# EAGLE schematic PowerSupplyCarlos (EAGLE 6.5.0)
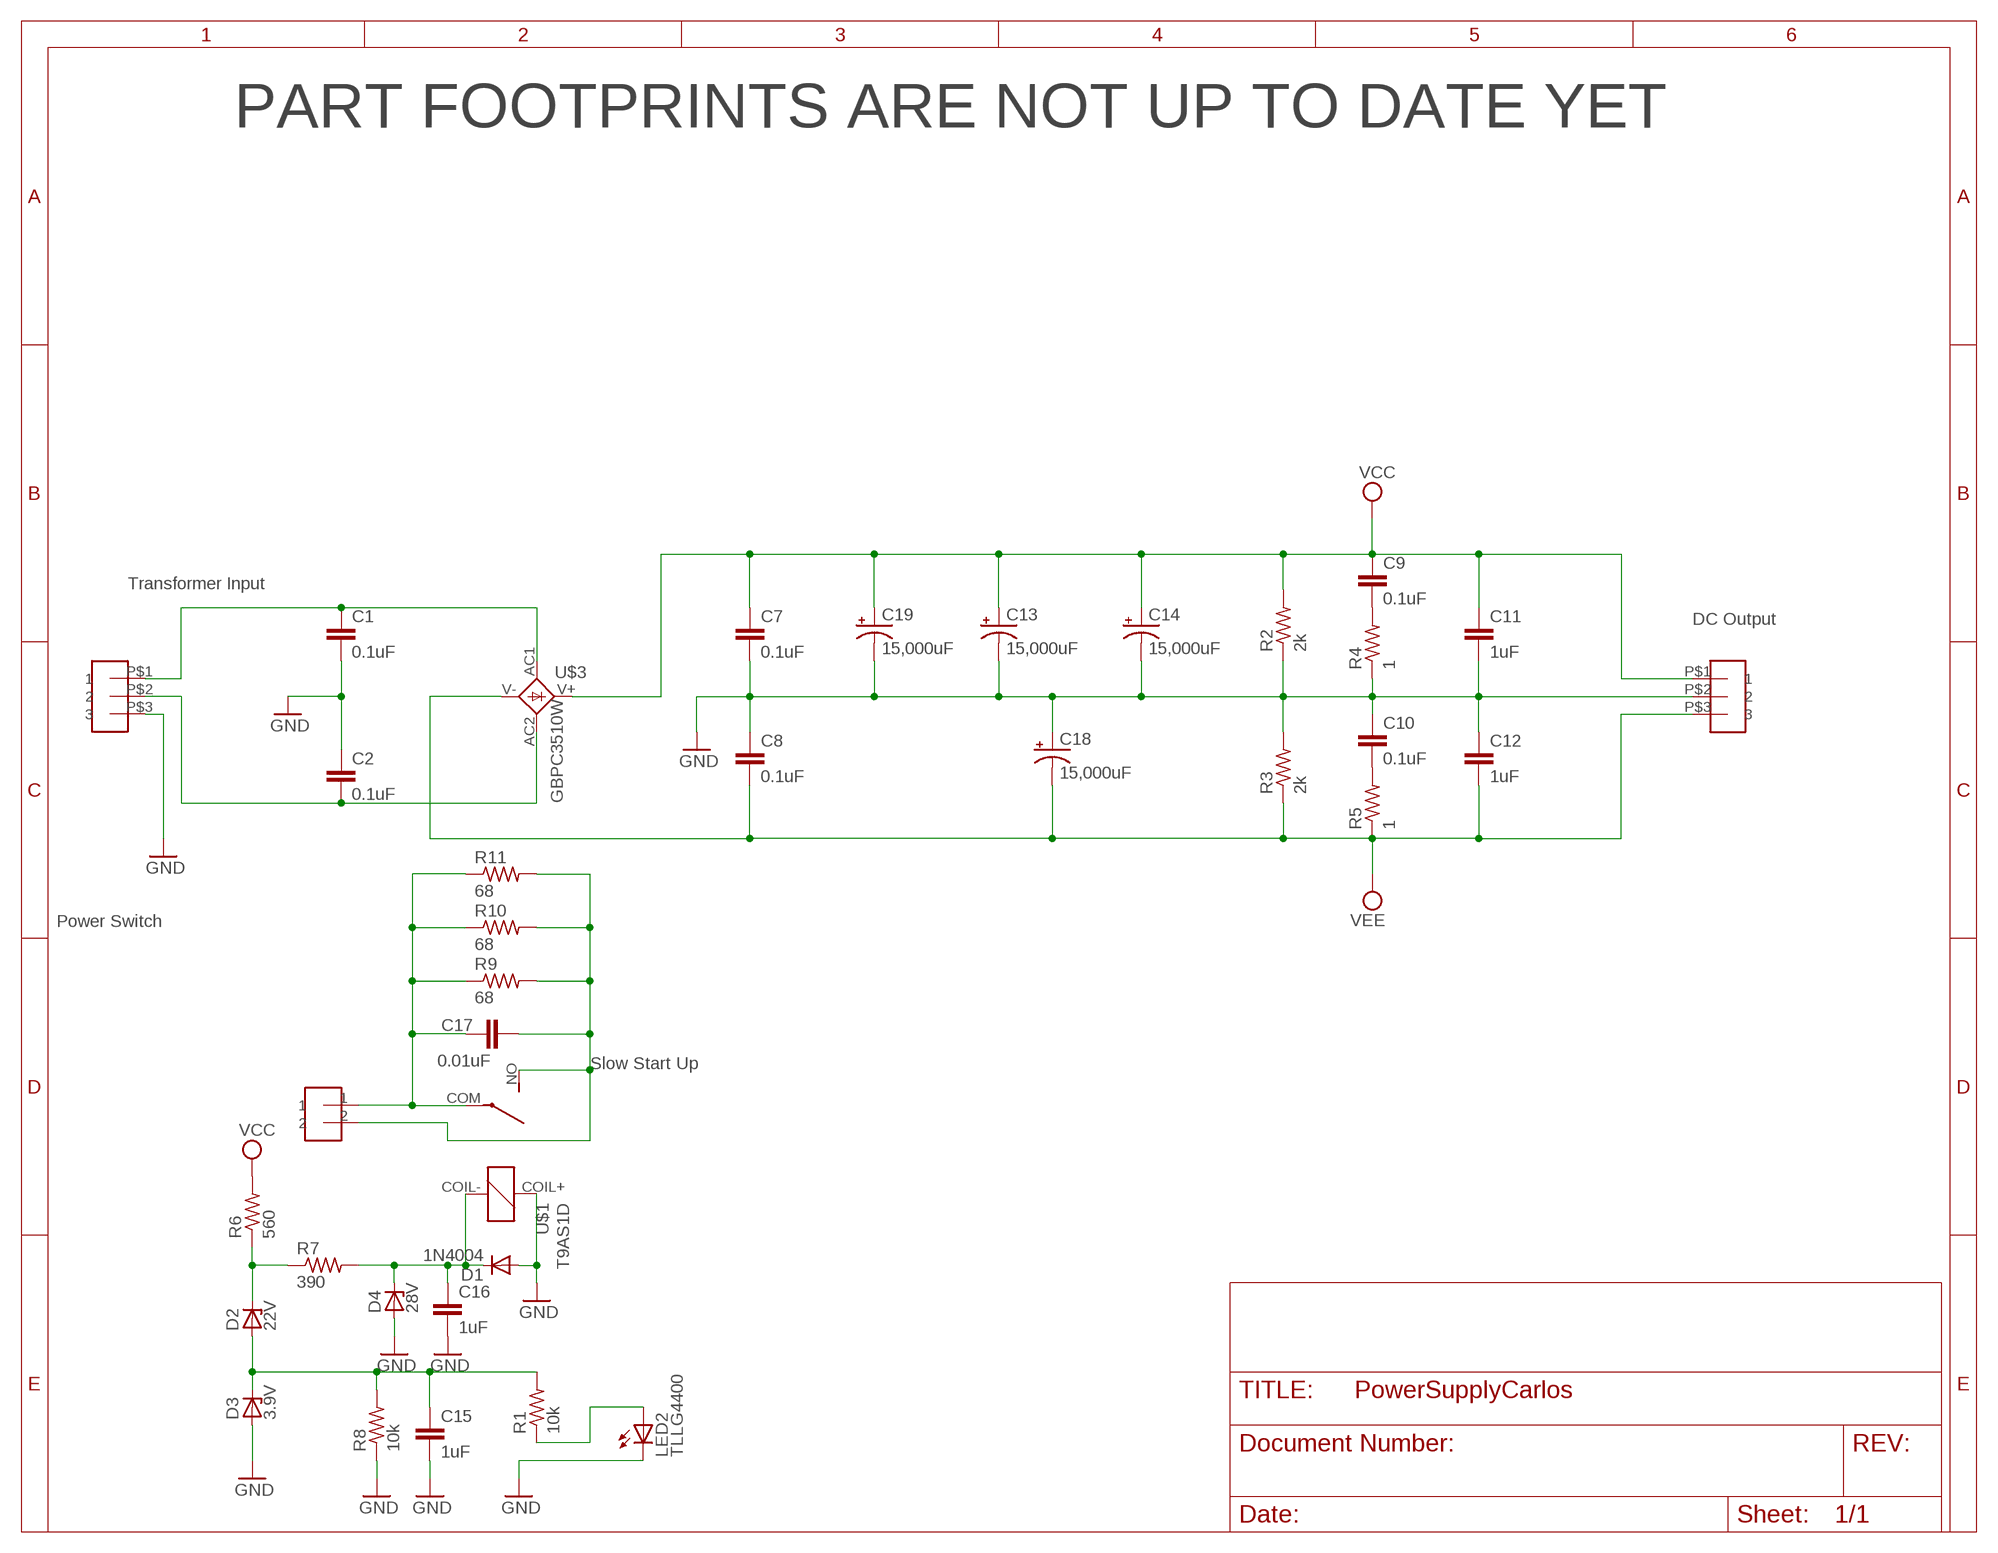
[diagram p0: schematic, sheet 1]

## Parts
C1  0.1uF  C-EU102-064X133  [C102-064X133]
C2  0.1uF  C-EU102-064X133  [C102-064X133]
C7  0.1uF  C-EU102-064X133  [C102-064X133]
C8  0.1uF  C-EU102-064X133  [C102-064X133]
C9  0.1uF  C-EU102-064X133  [C102-064X133]
C10  0.1uF  C-EU102-064X133  [C102-064X133]
C11  1uF  C-EU102-064X133  [C102-064X133]
C12  1uF  C-EU102-064X133  [C102-064X133]
C13  15,000uF  LNR1K153MSE  [PHI-35]
C14  15,000uF  LNR1K153MSE  [PHI-35]
C15  1uF  C-EU025-060X050  [C025-060X050]
C16  1uF  C-EU025-060X050  [C025-060X050]
C17  0.01uF  C-EU025-060X050  [C025-060X050]
C18  15,000uF  36X10222  [PHI-45]
C19  15,000uF  LNR1K153MSE  [PHI-35]
D1  1N4004  [DO41-10]
D2  22V  ZENER-DIODEP1-12  [P1Z12]
D3  3.9V  ZENER-DIODEDO34-7  [DO34Z7]
D4  28V  ZENER-DIODEP1-12  [P1Z12]
LED2  TLLG4400  [LED3MM]
P1  3PIN_3.25MM  [3PIN_SCREW_EYELET]
P2  3PIN_3.25MM  [3PIN_SCREW_EYELET]
R1  10k  R-US_0207/15  [0207/15]
R2  2k  R-US_VTA52  [VTA52]
R3  2k  R-US_VTA52  [VTA52]
R4  1  R-US_0411/12  [0411/12]
R5  1  R-US_0411/12  [0411/12]
R6  560  R-US_0207/15  [0207/15]
R7  390  R-US_0207/15  [0207/15]
R8  10k  R-US_0207/15  [0207/15]
R9  68  R-US_0617/22  [0617/22]
R10  68  R-US_0617/22  [0617/22]
R11  68  R-US_0617/22  [0617/22]
U$1  T9AS1D  [RELAY_CM]
U$3  GBPC3510W  [GBPC3510W]
U$4  1X2HEADER_100MIL  [1X2_100MIL]

## Nets
AC1: C1.1 P1.P$1 U$3.AC1
AC2: C2.2 P1.P$2 U$3.AC2
GND: C1.2 C2.1 C7.2 C8.1 C10.1 C11.2 C12.1 C13.- C14.- C15.2 C16.2 C18.+ C19.- D1.A D3.A D4.A LED2.K(C) P1.P$3 P2.P$2 R2.1 R3.2 R4.1 R8.1 U$1.COIL+
N$1: C10.2 R5.2
N$2: C9.2 R4.2
N$3: C17.1 R9.1 R10.1 R11.1 U$1.COM U$4.1
N$4: LED2.A R1.1
N$8: C17.2 R9.2 R10.2 R11.2 U$1.NO U$4.2
N$10: C16.1 D1.C D4.C R7.2 U$1.COIL-
N$11: D2.C R6.1 R7.1
N$12: C15.1 D2.A D3.C R1.2 R8.2
VCC: C7.1 C9.1 C11.1 C13.+ C14.+ C19.+ P2.P$1 R2.2 R6.2 U$3.V+(+)
VEE: C8.2 C12.2 C18.+1(-) P2.P$3 R3.1 R5.1 U$3.V-(-)

## Notes on the sheet
- PART FOOTPRINTS ARE NOT UP TO DATE YET
- Transformer Input
- DC Output
- Power Switch
- Slow Start Up

## Library data of the parts
C1 C2 C7-C12 C15-C17 = rcl:C-EU: CAPACITOR, European symbol
C13 C14 C19 = Amplifier_Parts:LNR1K153MSE
C18 = Amplifier_Parts:36X10222
D1 = diode:1N4004: DIODE general purpose rectifier, 1 A
D2-D4 = diode:ZENER-DIODE: Z-Diode
LED2 = led:TLLG4400: Low Current (2mA) LED 3 mm Tinted Diffused Package color GREEN Source: Data sheet <http://www.farnell.com/datasheets/391098.pdf>; MF: VISHAY SEMICONDUCTOR; OC_FARNELL: 1612435
P1 P2 = Amplifier_Parts:3PIN_3.25MM
R1 R6-R8 = resistor:R-US_: RESISTOR, American symbol
R2-R5 R9-R11 = rcl:R-US_: RESISTOR, American symbol
U$1 = Amplifier_Parts:T9AS1D
U$3 = Amplifier_Parts:GBPC3510W
U$4 = Headers:1X2HEADER_100MIL